# Altium schematic sheet Support.SchDoc: Gimbal Support Schematic
size Letter; DrawnBy: Aidan Gratton; Organization: UW Robotics; Address1: 200 University Avenue; Address2: Waterloo; Address3: Ontario; Address4: Canada N2L 3G6; SheetNumber: 5; SheetTotal: 5
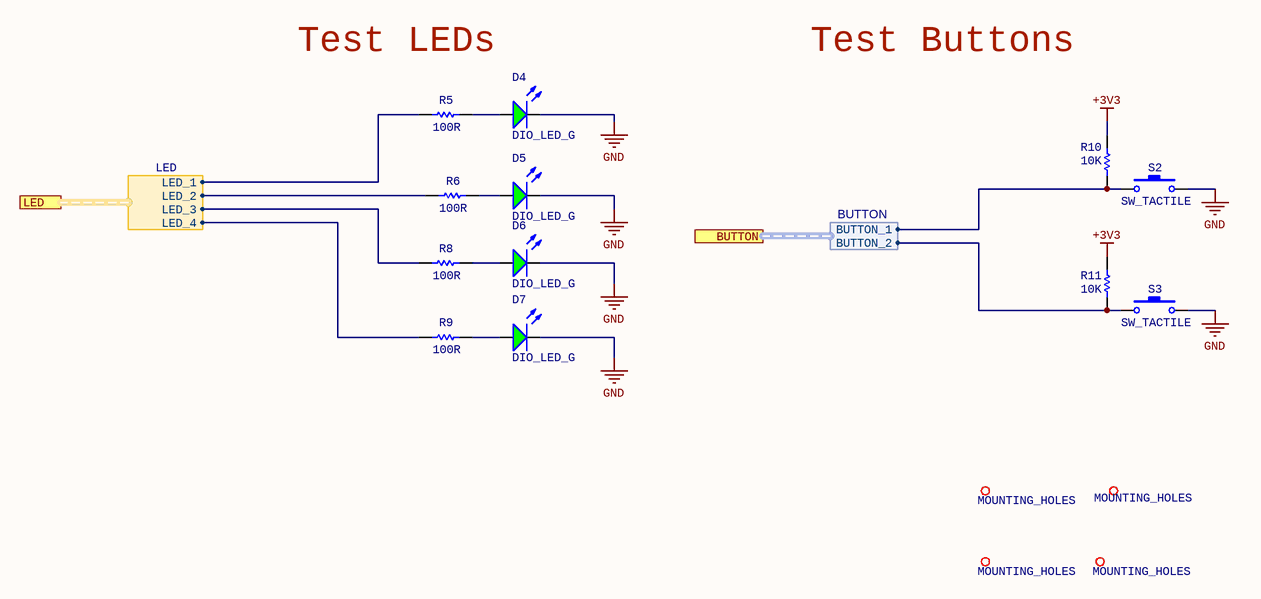
[diagram p0: Support.SchDoc]

## Parts
D4  DIO_LED_G  [LED_0805_LINE]
D5  DIO_LED_G  [LED_0805_LINE]
D6  DIO_LED_G  [LED_0805_LINE]
D7  DIO_LED_G  [LED_0805_LINE]
MH1  MOUNTING_HOLES  [MOUNTING_HOLE]
MH2  MOUNTING_HOLES  [MOUNTING_HOLE]
MH3  MOUNTING_HOLES  [MOUNTING_HOLE]
MH4  MOUNTING_HOLES  [MOUNTING_HOLE]
R5  value 100R  [RESC0603(1608)_N]  (hidden comment: RES_100R_0603)
R6  value 100R  [RESC0603(1608)_N]  (hidden comment: RES_100R_0603)
R8  value 100R  [RESC0603(1608)_N]  (hidden comment: RES_100R_0603)
R9  value 100R  [RESC0603(1608)_N]  (hidden comment: RES_100R_0603)
R10  value 10K  [RESC0603(1608)_N]  (hidden comment: RES_10K_0603)
R11  value 10K  [RESC0603(1608)_N]  (hidden comment: RES_10K_0603)
S2  SW_TACTILE  [B3U-1100P]
S3  SW_TACTILE  [B3U-1100P]

## Ports
BUTTON (harness BUTTON), LED (harness LED)

## Harnesses
LED: LED_1, LED_2, LED_3, LED_4
BUTTON: BUTTON_1, BUTTON_2

## Nets
+3V3: R10.1 R11.2
GND: D4.2(K) D5.2(K) D6.2(K) D7.2(K) S2.2 S3.2
NetD4_1: D4.1(A) R5.2
NetD5_1: D5.1(A) R6.2
NetD6_1: D6.1(A) R8.2
NetD7_1: D7.1(A) R9.2
NetR5_1: R5.1 ; port LED.LED_1
NetR6_1: R6.1 ; port LED.LED_2
NetR8_1: R8.1 ; port LED.LED_3
NetR9_1: R9.1 ; port LED.LED_4
NetR10_2: R10.2 S2.1 ; port BUTTON.BUTTON_1
NetR11_1: R11.1 S3.1 ; port BUTTON.BUTTON_2

## Notes on the sheet
- Test LEDs
- Test Buttons
- Title
- Size:
- Date:
- Letter
- Drawn By:
- Sheet
- of
- File:

## Library data of the parts
D4-D7 = DIO_LED_G: LED GREEN DIFFUSED 0805 SMD; Manufacturer: OSRAM; MPN: LG R971-KN-1; Forward Voltage Drop: 2.2V; Package: 0805 (2012 Metric); Supplier Part Number 1: 475-1410-1-ND; Supplier 1: Digi-Key
MH1-MH4 = MOUNTING_HOLES: 6cm x 6cm
R5 R6 R8 R9 = RES_100R_0603: RES SMD 100 OHM 1% 1/10W 0603; Manufacturer: Yageo; MPN: RC0603FR-07100RL; Package: 0603 (1608 Metric); Dimensions: 0.063" L x 0.031" W (1.60mm x 0.80mm); Tolerance: 1%; Supplier Part Number 1: 311-100HRCT-ND; Supplier 1: Digi-Key
R10 R11 = RES_10K_0603: RES SMD 10K OHM 5% 1/10W 0603; Manufacturer: Yageo; MPN: RC0603JR-0710KL; Package: 0603 (1608 Metric); Dimensions: 0.063" L x 0.031" W (1.60mm x 0.80mm); Tolerance: 5%; Supplier Part Number 1: 311-10KGRCT-ND; Supplier 1: Digi-Key
S2 S3 = SW_TACTILE: Tactile Switch (Grey); Manufacturer: Omron Electronics Inc-EMC Div; MPN: B3U-1100P; Supplier Part Number 1: SW1021CT-ND; Supplier 1: Digi-Key